# EAGLE design v0.9 (EAGLE 7.2.0)
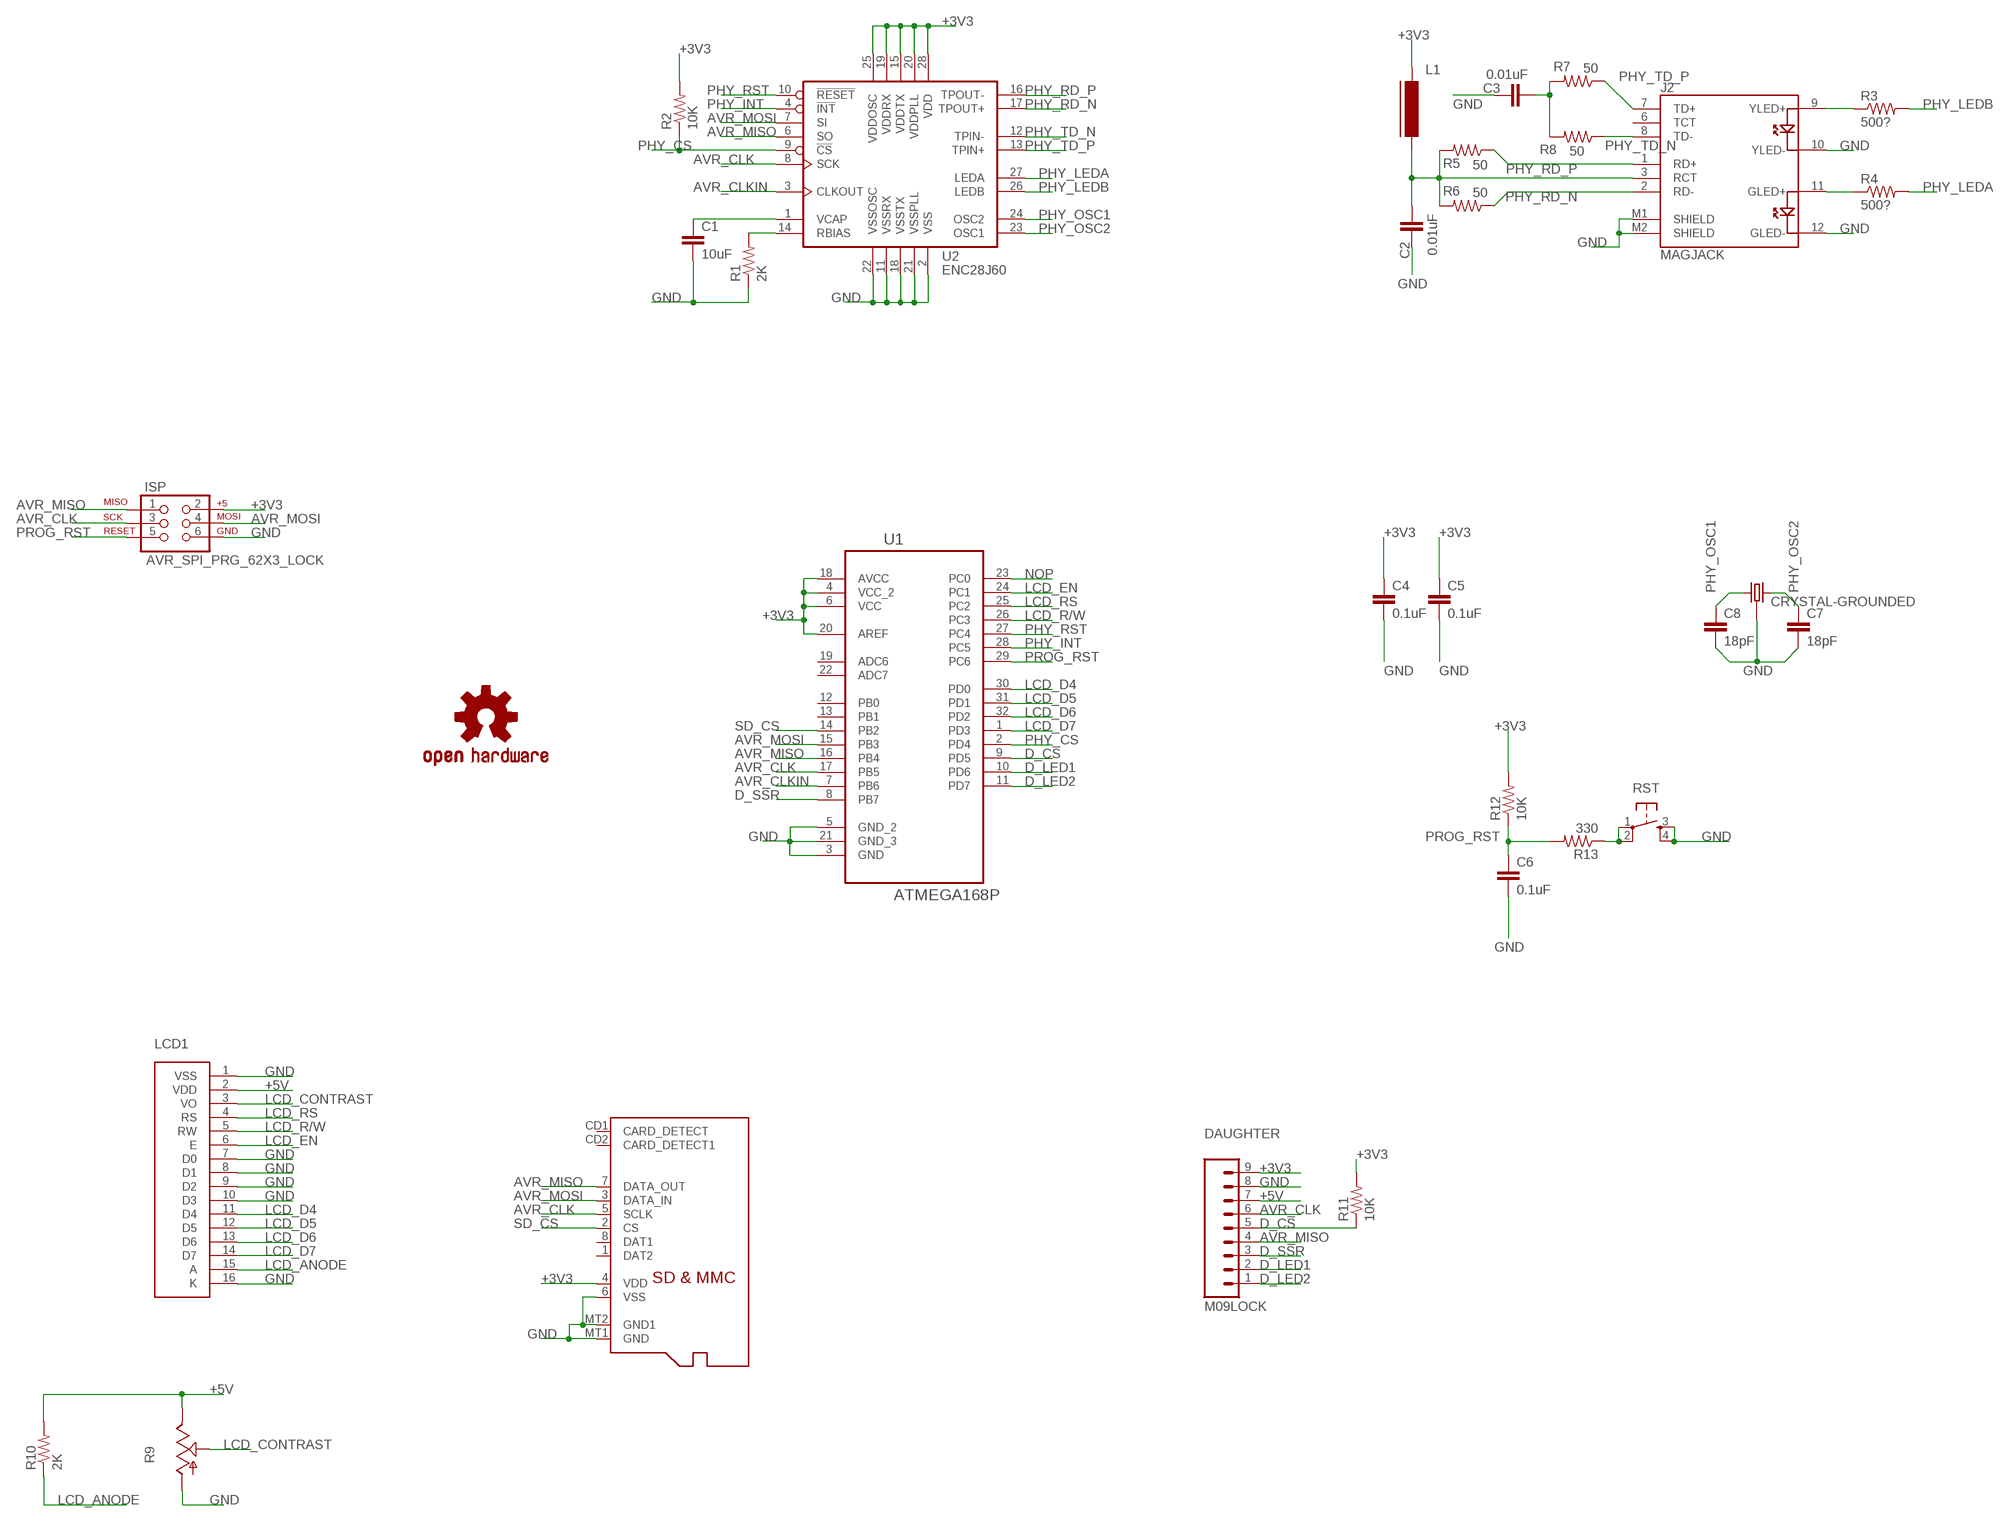
[diagram p0: schematic, sheet 1]

## Parts
C1  10uF  10UF-6.3V-20%(0603)  [0603-CAP]
C2  0.01uF  CAP0603-CAP  [0603-CAP]
C3  0.01uF  CAP0603-CAP  [0603-CAP]
C4  0.1uF  CAP0402-CAP  [0402-CAP]
C5  0.1uF  CAP0402-CAP  [0402-CAP]
C6  0.1uF  CAP0603-CAP  [0603-CAP]
C7  18pF  CAP0402-CAP  [0402-CAP]
C8  18pF  CAP0402-CAP  [0402-CAP]
DAUGHTER  M09LOCK  [1X09_LOCK]
ISP  AVR_SPI_PRG_62X3_LOCK  [2X3_LOCK]
J2  MAGJACK  [MAGJACK]
L1  FERRITE-0603  [FB603]
LCD1  HD44780  [.1"16PIN]
LOGO1  OSHW-LOGOS  [OSHW-LOGO-S]
R1  2K  RESISTOR0603-RES  [0603-RES]
R2  10K  RESISTOR0603-RES  [0603-RES]
R3  500?  RESISTOR0603-RES  [0603-RES]
R4  500?  RESISTOR0603-RES  [0603-RES]
R5  50  RESISTOR0603-RES  [0603-RES]
R6  50  RESISTOR0603-RES  [0603-RES]
R7  50  RESISTOR0603-RES  [0603-RES]
R8  50  RESISTOR0603-RES  [0603-RES]
R9  TRIM_US-B64Y  [B64Y]
R10  2K  RESISTOR0603-RES  [0603-RES]
R11  10K  RESISTOR0603-RES  [0603-RES]
R12  10K  RESISTOR0603-RES  [0603-RES]
R13  330  RESISTOR0603-RES  [0603-RES]
RST  TAC_SWITCHSMD  [TACTILE-SWITCH-SMD]
SD  MICROSD  [MICROSD]
U1  ATMEGA168P  ATMEGA168P-20AU  [QFP80P900X900X120-32N]
U2  ENC28J60  IC_ENC28J60-SOIC-28  [SOIC-28W]
Y1  CRYSTAL-GROUNDED  [CRYSTAL-SMD-5X3]

## Nets
+3V3: C4.1 C5.1 DAUGHTER.9 ISP.2 L1.1 R2.2 R11.2 R12.2 SD.4(VDD) U1.4(VCC_2) U1.6(VCC) U1.18(AVCC) U1.20(AREF) U2.15(VDDTX) U2.19(VDDRX) U2.20(VDDPLL) U2.25(VDDOSC) U2.28(VDD)
+5V: DAUGHTER.7 LCD1.2(VDD) R9.E R10.2
AVR_CLK: DAUGHTER.6 ISP.3 SD.5(SCLK) U1.17(PB5) U2.8(SCK)
AVR_CLKIN: U1.7(PB6) U2.3(CLKOUT)
AVR_MISO: DAUGHTER.4 ISP.1 SD.7(DATA_OUT) U1.16(PB4) U2.6(SO)
AVR_MOSI: ISP.4 SD.3(DATA_IN) U1.15(PB3) U2.7(SI)
D_CS: DAUGHTER.5 R11.1 U1.9(PD5)
D_LED1: DAUGHTER.2 U1.10(PD6)
D_LED2: DAUGHTER.1 U1.11(PD7)
D_SSR: DAUGHTER.3 U1.8(PB7)
GND: C1.2 C2.1 C3.1 C4.2 C5.2 C6.2 C7.2 C8.2 DAUGHTER.8 ISP.6 J2.10(YLED-) J2.12(GLED-) J2.M1(SHIELD) J2.M2(SHIELD) LCD1.1(VSS) LCD1.7(D0) LCD1.8(D1) LCD1.9(D2) LCD1.10(D3) LCD1.16(K) R1.1 R9.A RST.3 RST.4 SD.6(VSS) SD.MT1(GND) SD.MT2(GND1) U1.3(GND) U1.5(GND_2) U1.21(GND_3) U2.2(VSS) U2.11(VSSRX) U2.18(VSSTX) U2.21(VSSPLL) U2.22(VSSOSC) Y1.2 Y1.4
LCD_ANODE: LCD1.15(A) R10.1
LCD_CONTRAST: LCD1.3(VO) R9.S
LCD_D4: LCD1.11(D4) U1.30(PD0)
LCD_D5: LCD1.12(D5) U1.31(PD1)
LCD_D6: LCD1.13(D6) U1.32(PD2)
LCD_D7: LCD1.14(D7) U1.1(PD3)
LCD_EN: LCD1.6(E) U1.24(PC1)
LCD_R/W: LCD1.5(RW) U1.26(PC3)
LCD_RS: LCD1.4(RS) U1.25(PC2)
N$1: J2.11(GLED+) R4.1
N$2: J2.9(YLED+) R3.1
N$4: R13.1 RST.1 RST.2
N$7: C1.1 U2.1(VCAP)
N$8: R1.2 U2.14(RBIAS)
NOP: U1.23(PC0)
PHY_CS: R2.1 U1.2(PD4) U2.9(!CS)
PHY_INT: U1.28(PC5) U2.4(!INT)
PHY_LEDA: R4.2 U2.27(LEDA)
PHY_LEDB: R3.2 U2.26(LEDB)
PHY_OSC1: C8.1 U2.24(OSC2) Y1.3
PHY_OSC2: C7.1 U2.23(OSC1) Y1.1
PHY_RD_N: J2.2(RD-) R6.1 U2.17(TPOUT+)
PHY_RD_P: J2.1(RD+) R5.1 U2.16(TPOUT-)
PHY_RST: U1.27(PC4) U2.10(!RESET)
PHY_TD_N: J2.8(TD-) R8.1 U2.12(TPIN-)
PHY_TD_P: J2.7(TD+) R7.1 U2.13(TPIN+)
PROG_RST: C6.1 ISP.5 R12.1 R13.2 U1.29(PC6)
RCT: C2.2 J2.3(RCT) L1.2 R5.2 R6.2
SD_CS: SD.2(CS) U1.14(PB2)
TDCAP: C3.2 R7.2 R8.2
Unconnected: J2.6(TCT) SD.1(DAT2) SD.8(DAT1) SD.CD1(CARD_DETECT) SD.CD2(CARD_DETECT1) U1.12(PB0) U1.13(PB1) U1.19(ADC6) U1.22(ADC7)

## Library data of the parts
C1 = SparkFun-Capacitors:10UF-6.3V-20%(0603): CAP-11015; PROD_ID: CAP-11015
C2-C8 = SparkFun-Passives:CAP: Capacitor Standard 0603 ceramic capacitor, and 0.1" leaded capacitor.
DAUGHTER = SparkFun-Connectors:M09: Header 9 Standard 9-pin 0.1" header. Use with straight break away headers (SKU : PRT-00116), right angle break away headers (PRT-00553), swiss pins (PRT-00743), machine pins (PRT-00117), and female headers (PRT-00115).
ISP = SparkFun-Connectors:AVR_SPI_PRG_6: AVR ISP 6 Pin This is the reduced ISP connector for AVR programming. Common on Arduino. This footprint will take up less PCB space and can be used with a 10-pin to 6-pin adapter such as SKU: BOB-08508 **Special note about "TEST_POINT" package. The stop mask is on the top side, so if you want your programming test points to be on the bottom of your board, make sure to place this package on the bottom side of the board. This also ensure that the orientation to program from the bottom side will be correct.
J2 = SparkFun-Connectors:MAGJACK: RJ-45 with LEDs
L1 = dp_devices:FERRITE: Ferrite bead in various packages
LCD1 = custom-LCD:HD44780
LOGO1 = SparkFun-Aesthetics:OSHW-LOGO: Open Source Hardware Logo This logo indicates the piece of hardware it is found on incorporates a OSHW license and/or adheres to the definition of open source hardware found here: http://freedomdefined.org/OSHW
R1-R8 R10-R13 = SparkFun-Passives:RESISTOR: Resistor Basic schematic elements and footprints for 0603, 1206, and PTH resistors.
R9 = pot:TRIM_US-: POTENTIOMETER
RST = SparkFun-Electromechanical:TAC_SWITCH: Momentary Switch Button commonly used for reset or general input. Spark Fun Electronics SKU : COM-00097 SMT- SWCH-08247
SD = adafruit:MICROSD: Micro-SD / Transflash card holder with SPI pinout For the 3M # 2908-05WB-MG and/or 4UCON #19656 push-push type
U1 = Atmel_By_element14_Batch_1-00:ATMEGA168P-20AU: 8-bit Microcontroller with In-System Programmable Flash; MPN: ATMEGA168P-20AU; OC_FARNELL: 1636932; OC_NEWARK: 03P2020; PACKAGE: TQFP-32; SUPPLIER: Atmel
U2 = dp_devices:IC_ENC28J60: Ethernet Controller with SPI Interface
Y1 = SparkFun-FreqCtrl:CRYSTAL-GROUNDED

## Board
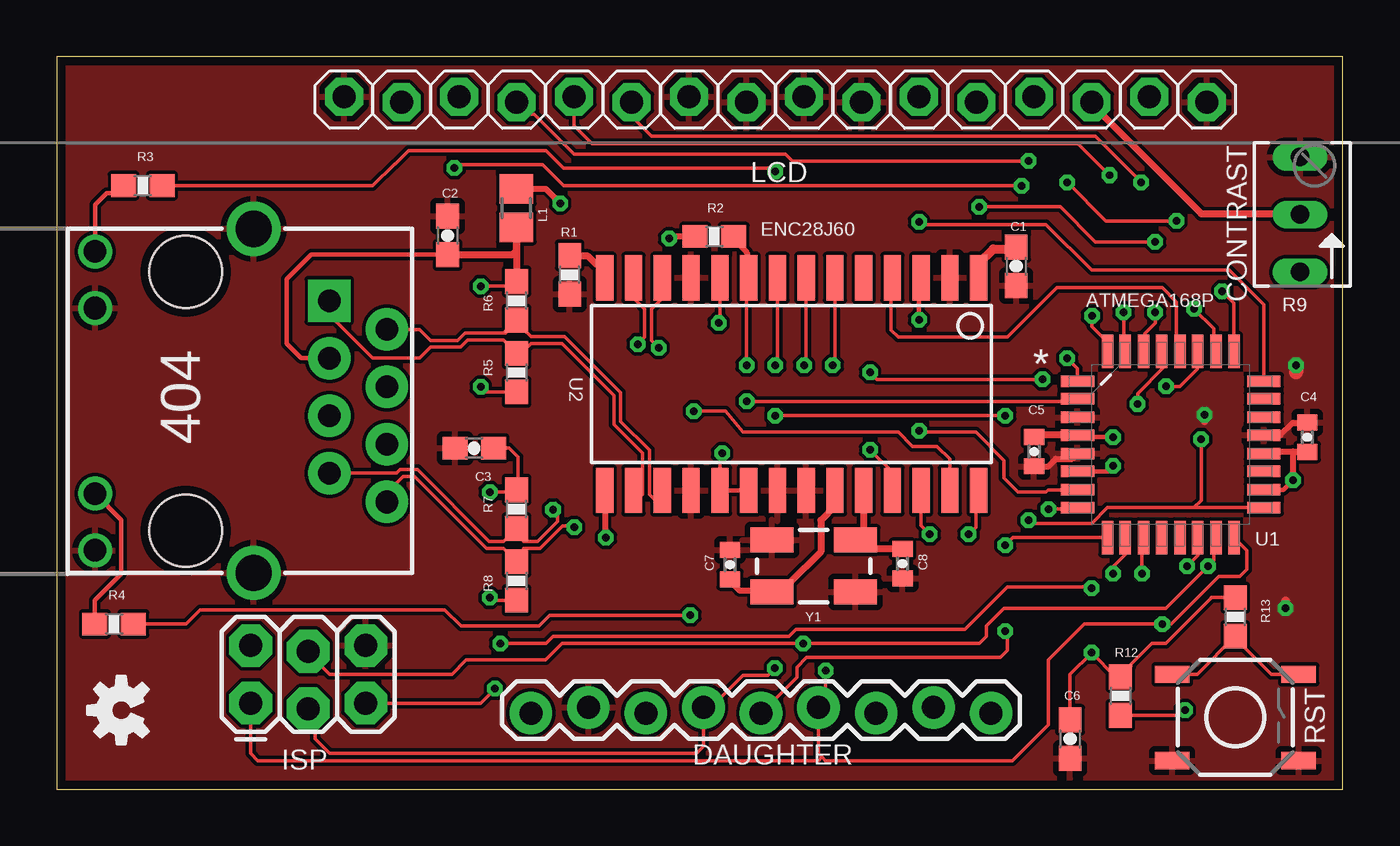
[diagram p1: board, top side]
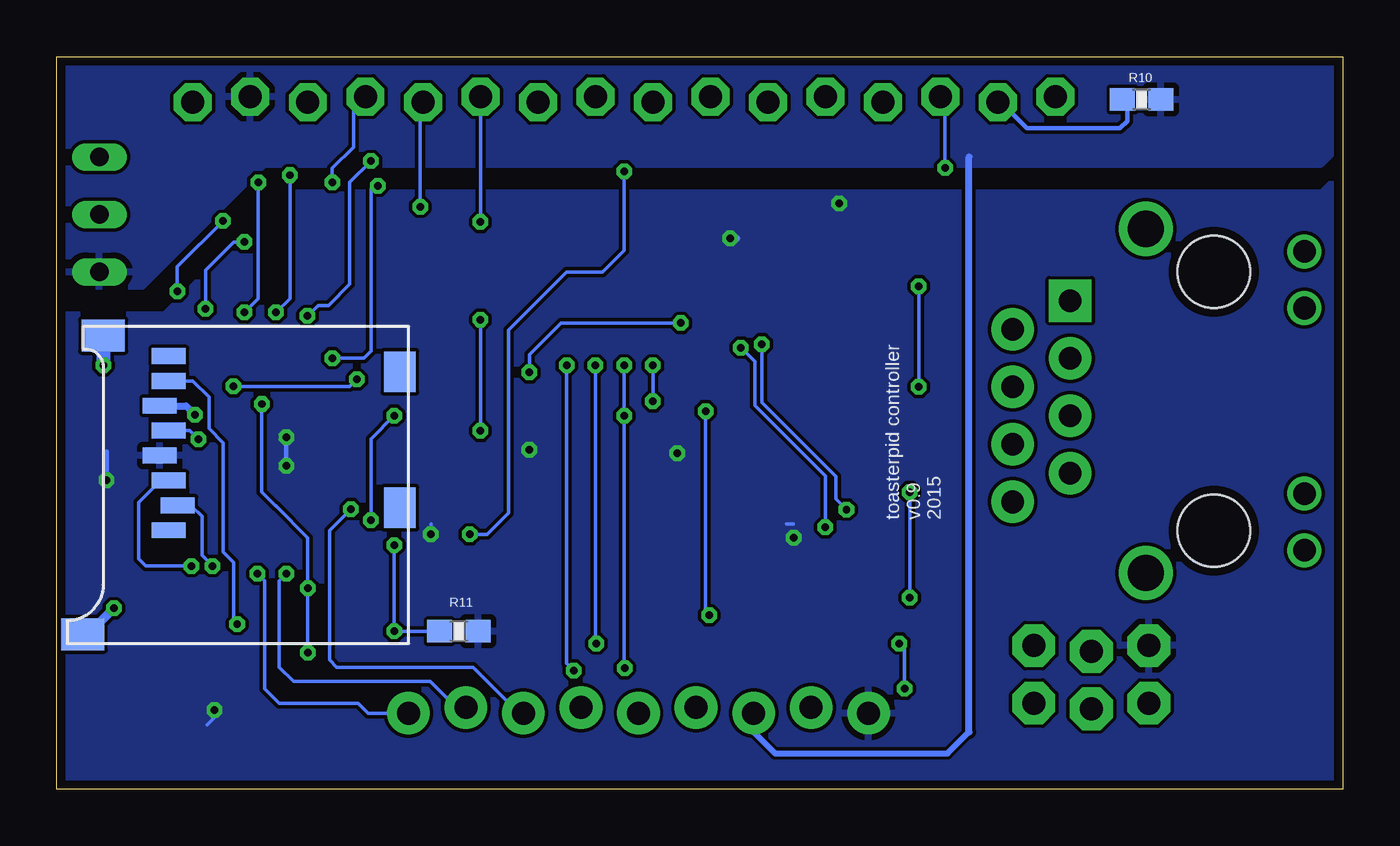
[diagram p2: board, bottom side, seen from below]

Size 56.82 x 32.38 mm. Coordinates in mm from the lower left corner, seen from the top.
Outline: 0,0 56.82,0 56.82,32.38 0,32.38 0,0
Copper layers (1*16): Top 0.0356mm / dielectric 1.5011mm / Bottom 0.0356mm
Design rules "LaenPCBOrder *": minimum track width 6mil, minimum drill 13mil, track to track 6mil, track to pad 6mil, pad to pad 6mil, via to via 6mil, smd to smd 6mil, copper to edge 15mil, drill to drill 6mil, minimum pad ring 7mil, minimum via ring 7mil, stop-mask expansion 3mil, vias tented up to drill 15mil, thermal gap 10mil

### Footprints (pad centres in the part's own frame; a part is rotated, then mirrored left to right if it is on the bottom)
0603-CAP = smd 1.1 x 1: 1 -0.85,0; 2 0.85,0
0402-CAP = smd 0.7 x 0.9: 1 -0.65,0; 2 0.65,0
1X09_LOCK = drill 1.016 pad 1.88: 1 0,0.127; 2 2.54,-0.127; 3 5.08,0.127; 4 7.62,-0.127; 5 10.16,0.127; 6 12.7,-0.127; 7 15.24,0.127; 8 17.78,-0.127; 9 20.32,0.127
2X3_LOCK = drill 1.016 pad 1.88 octagon: 1 0,0; 2 0,2.54; 3 2.54,-0.254; 4 2.54,2.286; 5 5.08,0; 6 5.08,2.54
MAGJACK = drill 1 pad 1.88 square: 1 3.175,17.445 | drill 1 pad 1.88: 2 4.445,19.985; 3 5.715,17.445; 4 6.985,19.985; 5 8.255,17.445; 6 9.525,19.985; 7 10.795,17.445; 8 12.065,19.985 | drill 1 pad 1.27: 9 1,7.1; 10 3.5,7.1; 11 11.7,7.1; 12 14.2,7.1 | drill 1.6 pad 2.184: M1 0,14.1; M2 15.2,14.1 | hole 3.2: 1.905,11.095; 13.335,11.095
FB603 = smd 1.3 x 1.5: 1 -0.85,0; 2 0.85,0
.1"16PIN = drill 1.016 pad 1.676 octagon: 1 0,0.127; 2 2.54,-0.127; 3 5.08,0.127; 4 7.62,-0.127; 5 10.16,0.127; 6 12.7,-0.127; 7 15.24,0.127; 8 17.78,-0.127; 9 20.32,0.127; 10 22.86,-0.127; 11 25.4,0.127; 12 27.94,-0.127; 13 30.48,0.127; 14 33.02,-0.127; 15 35.56,0.127; 16 38.1,-0.127
0603-RES = smd 1.1 x 1: 1 -0.85,0; 2 0.85,0
B64Y = drill 0.813 long: A 2.54,0; E -2.54,0; S 0,0
TACTILE-SWITCH-SMD = smd 1.524 x 0.762: 1 -2.794,1.905; 2 2.794,1.905; 3 -2.794,-1.905; 4 2.794,-1.905
MICROSD = smd 0.7 x 1.5: 1 9,-10.64; 2 7.9,-10.24; 3 6.8,-10.64; 4 5.7,-11.04; 5 4.6,-10.64; 6 3.5,-11.04; 7 2.4,-10.64; 8 1.3,-10.64 | smd 1.8 x 1.4: CD1 2,-0.44; CD2 8,-0.44 | smd 1.4 x 1.9: MT1 0.4,-13.54; MT2 13.6,-14.44
QFP80P900X900X120-32N = smd 1.473 x 0.508: 1 -4.115,2.794; 2 -4.115,2.007; 3 -4.115,1.194; 4 -4.115,0.406; 5 -4.115,-0.406; 6 -4.115,-1.194; 7 -4.115,-2.007; 8 -4.115,-2.794; 17 4.115,-2.794; 18 4.115,-2.007; 19 4.115,-1.194; 20 4.115,-0.406; 21 4.115,0.406; 22 4.115,1.194; 23 4.115,2.007; 24 4.115,2.794 | smd 0.508 x 1.473: 9 -2.794,-4.115; 10 -2.007,-4.115; 11 -1.194,-4.115; 12 -0.406,-4.115; 13 0.406,-4.115; 14 1.194,-4.115; 15 2.007,-4.115; 16 2.794,-4.115; 25 2.794,4.115; 26 2.007,4.115; 27 1.194,4.115; 28 0.406,4.115; 29 -0.406,4.115; 30 -1.194,4.115; 31 -2.007,4.115; 32 -2.794,4.115
SOIC-28W = smd 0.762 x 2: 1 -8.89,-4.7; 2 -7.62,-4.7; 3 -6.35,-4.7; 4 -5.08,-4.7; 5 -3.81,-4.7; 6 -2.54,-4.7; 7 -1.27,-4.7; 8 0,-4.7; 9 1.27,-4.7; 10 2.54,-4.7; 11 3.81,-4.7; 12 5.08,-4.7; 13 6.35,-4.7; 14 7.62,-4.7; 15 7.62,4.7; 16 6.35,4.7; 17 5.08,4.7; 18 3.81,4.7; 19 2.54,4.7; 20 1.27,4.7; 21 0,4.7; 22 -1.27,4.7; 23 -2.54,4.7; 24 -3.81,4.7; 25 -5.08,4.7; 26 -6.35,4.7; 27 -7.62,4.7; 28 -8.89,4.7
CRYSTAL-SMD-5X3 = smd 1.9 x 1.1: 1 -1.85,-1.15; 2 1.85,-1.15; 3 1.85,1.15; 4 -1.85,1.15

### Placement (x,y rotation side)
C1  42.39,23.11 270 top
C2  17.27,24.47 270 top
C3  18.44,15.07 0 top
C4  55.24,15.56 90 top
C5  43.18,14.92 270 top
C6  44.77,2.22 270 top
C7  29.74,9.93 90 top
C8  37.37,9.97 270 top
DAUGHTER  41.27,3.49 180 top
ISP  8.57,3.81 0 top
J2  -5.4,24.77 270 top
L1  20.31,25.68 270 top
LCD1  50.8,30.48 180 top
LOGO1  2.86,3.49 90 top
R1  22.66,22.74 90 top
R2  29.05,24.43 180 top
R3  3.81,26.67 0 top
R4  2.54,7.3 0 top
R5  20.32,18.41 270 top
R6  20.32,21.59 90 top
R7  20.32,12.38 90 top
R8  20.32,9.21 270 top
R9  54.93,25.4 90 top
R10  8.89,30.48 0 bottom
R11  39.05,6.98 0 bottom
R12  46.99,4.13 270 top
R13  52.07,7.62 90 top
RST  52.07,3.17 0 top
SD  41.22,20.45 270 bottom
U1  49.21,15.24 0 top
U2  31.84,17.9 180 top
Y1  33.44,9.87 0 top

### Tracks (layer width: path | path; a pad name or v marks a point on that pad's centre or on a via)
+3V3  (via drill 0.33, 0.33 pad 0.25, 0.33 pad 0.3)
  Top 0.152: 54.61,14.92 54.63,14.92 | R12.2 49.63,3.28 v49.85,3.49 | U2.28 40.6,13.07 40.6,11.58 v40.29,11.27 | U2.25 36.92,14.01 v35.93,15 | U2.19 29.3,14.75 v29.4,14.85
  Top 0.203: U1.18 54.19,13.23 v54.61,13.65 | 53.42,14.92 U1.20 | U1.6 46.43,14.05 v46.67,14.29 | v46.67,15.56 45.19,15.56 U1.4 | U2.20 U2.19 29.3,12.29
  Top 0.254: 53.42,14.92 54.61,14.92 v54.61,13.65 | L1.1 21.6,26.53 v22.24,25.89 | R2.2 27.16,24.43 v27.06,24.34 | U2.15 24.22,11.16 v24.26,11.11
  Top 0.305: 54.63,14.92 C4.1 | U1.4 43.25,15.65 C5.1
  Bottom 0.152: v49.85,3.49 49.85,3.17 50.17,2.86 | 40.29,11.73 v40.29,11.27 | 24.26,11.73 24.57,11.73
  Bottom 0.203: v54.61,13.65 54.61,14.92 | v46.67,14.29 v46.67,15.56
  Bottom 0.254: v27.06,24.34 26.75,24.34 | v24.26,11.11 24.42,11.11
  pour Bottom: 0.32,26.99 0.95,26.35 46.67,26.35 52.07,20.95 56.52,20.95 56.52,0 0,0 0.32,0.32
+5V
  Bottom 0.254: DAUGHTER.7 26.03,2.54 25.08,1.59 17.46,1.59 16.51,2.54
  Bottom 0.305: 16.51,2.54 16.51,27.94
  pour Bottom: 0,28.58 0,32.38 56.83,32.38 56.83,22.23 53.02,22.23 51.75,23.5 47.62,27.62 0.95,27.62
AVR_CLK  (via drill 0.33, 0.33 pad 0.3)
  Top 0.152: U2.8 31.84,18.82 v31.75,18.73 | U1.17 50.24,12.45 | 50.24,12.45 46.42,12.45 45.72,11.75 43.08,11.75 v42.93,11.89 | v41.91,16.51 32.07,16.51 v31.75,16.5 | ISP.3 11.43,3.24 11.43,2.22 12.07,1.59 28.26,1.59 28.57,1.9 DAUGHTER.6 28.89,3.94 29.22,3.94 30.33,5.04 31.42,5.04 v31.73,5.36 | v50.56,15.47 50.56,12.76 50.24,12.45
  Bottom 0.152: v31.75,18.73 v31.75,16.5 31.75,5.38 v31.73,5.36 | SD.5 50.93,15.85 v50.56,15.47 | v42.93,11.89 42.93,15.49 v41.91,16.51
AVR_CLKIN  (via drill 0.33)
  Top 0.152: U1.7 43.81,13.23 43.71,13.13 42.47,13.13 41.84,13.76 41.84,14.54 40.6,15.78 38.19,15.78 v38.1,15.84
  Top 0.203: v38.1,20.75 38.1,21.68 38.11,21.69 38.11,22.52 U2.3
  Bottom 0.152: v38.1,20.75 v38.1,15.84
AVR_MISO  (via drill 0.33)
  Top 0.152: 33.81,1.43 33.65,1.59 DAUGHTER.4 33.97,3.94 v33.97,5.25 | 33.81,1.43 33.97,1.27 42.23,1.27 43.82,2.86 43.82,5.71 45.4,7.3 v48.84,7.3 49.23,7.3 51.33,9.4 52.27,9.4 52.58,9.71 52.58,10.55 U1.16 52.07,11.06 52.07,10.48 | U2.6 34.38,18.82 v34.29,18.73 | ISP.1 8.57,1.59 8.89,1.27 33.65,1.27 33.81,1.43
  Bottom 0.152: v34.29,18.73 34.29,5.57 v33.97,5.25 | SD.7 50.8,18.05 50.09,17.34 50.09,15.93 49.47,15.31 49.47,10.49 49,10.02 49,7.46 v48.84,7.3
AVR_MOSI  (via drill 0.33, 0.33 pad 0.3)
  Top 0.152: U2.7 33.11,18.82 v33.02,18.73 | ISP.4 11.11,6.03 12.07,5.08 17.46,5.08 18.1,5.71 21.59,5.71 22.32,6.45 v32.98,6.45 40.75,6.45 41.07,6.76 41.07,7.22 41.84,8 49,8 v50.87,9.87 51.12,10.12 51.12,11.02 U1.15 51.18,11.08
  Bottom 0.152: v33.02,18.73 33.02,6.49 v32.98,6.45 | SD.3 52.22,13.65 53.2,12.67 53.2,10.18 52.89,9.87 v50.87,9.87
D_CS  (via drill 0.33)
  Top 0.152: U1.9 42.24,11.12 v41.91,10.79 | DAUGHTER.5 32.7,4.95 32.7,5.39 33.13,5.82 41.69,5.82 42,6.13 42,6.9 v41.91,6.98
  Bottom 0.152: v41.91,10.79 v41.91,6.98 R11.1
D_LED1  (via drill 0.33)
  Top 0.152: v46.67,9.53 46.67,9.84 47.31,10.48 47.31,11.02 U1.10
  Bottom 0.152: DAUGHTER.2 39.18,3.62 40.32,4.76 46.35,4.76 46.99,5.4 46.99,9.21 v46.67,9.53
D_LED2  (via drill 0.33)
  Top 0.152: v47.94,9.53 47.94,11.05 U1.11
  Bottom 0.152: DAUGHTER.1 43.05,3.37 43.5,3.81 46.99,3.81 47.63,4.45 47.63,9.21 v47.94,9.53
D_SSR  (via drill 0.33)
  Top 0.152: v43.82,12.38 45.03,12.38 U1.8
  Bottom 0.152: DAUGHTER.3 36.39,3.37 38.42,5.4 44.45,5.4 44.77,5.71 44.77,11.43 v43.82,12.38
GND  (via drill 0.33)
  Top 0.254: U1.21 54.06,15.65 54.61,16.19 55.23,16.19 C4.2 | C5.2 43.8,14.27 44.13,14.61 44.87,14.61 U1.5
  Top 0.305: v50.71,16.56 50.71,16.25
  Top 0.406: v54.29,8 54.29,8.31
  Top 0.61: v54.76,18.74 54.76,18.43
  Bottom 0.305: SD.6 51.1,16.95 v50.71,16.56
  Bottom 0.406: SD.MT2 55.44,6.85 v54.29,8
  Bottom 0.61: SD.MT1 v54.76,18.74
  pour Top: 0,32.38 0,0 56.83,0 56.83,0.95 56.83,32.38
LCD_ANODE
  Bottom 0.203: LCD1.15 15.11,30.35 13.97,29.21 9.84,29.21 9.52,29.53 9.52,30.27 R10.1
LCD_CONTRAST
  Top 0.305: LCD1.3 45.72,30.26 50.56,25.43 54.9,25.43 R9.S
LCD_D4  (via drill 0.33 pad 0.3)
  Top 0.152: LCD1.11 25.4,29.73 26.29,28.85 45.89,28.85 v47.91,26.83 | v48.53,21.07 48.53,20.6 48.07,20.14 48.07,19.4 U1.30
  Bottom 0.152: v47.91,26.83 47.91,21.69 v48.53,21.07
LCD_D5  (via drill 0.33 pad 0.3)
  Top 0.152: LCD1.12 22.86,29.32 23.64,28.54 45.11,28.54 v46.51,27.14 | v47.13,21.07 47.13,19.43 U1.31
  Bottom 0.152: v46.51,27.14 46.51,21.69 v47.13,21.07
LCD_D6  (via drill 0.33, 0.33 pad 0.3)
  Top 0.152: v45.73,20.91 45.73,20.45 46.42,19.76 U1.32 | v42.93,27.76 32.51,27.76 32.2,28.07 22.86,28.07 21.1,29.84 20.84,29.84 LCD1.13
  Bottom 0.152: v45.73,20.91 45.27,21.38 44.8,21.38 43.87,22.31 43.87,26.83 v42.93,27.76
LCD_D7  (via drill 0.33, 0.33 pad 0.3)
  Top 0.152: U1.1 45.1,18.59 v44.64,19.05 | v17.57,27.45 17.73,27.6 21.46,27.6 22.4,26.67 v42.62,26.67
  Bottom 0.152: v17.57,27.45 17.57,30.4 LCD1.14 | v44.64,19.05 43.24,19.05 42.93,19.36 42.93,26.51 v42.62,26.67
LCD_EN  (via drill 0.33)
  Top 0.152: U1.24 53.33,21.41 51.8,22.94 45.73,22.94 43.71,24.96 38.21,24.96 v38.1,25.07
  Bottom 0.152: LCD1.6 v38.1,25.07
LCD_R/W  (via drill 0.33)
  Top 0.152: U1.26 51.12,19.46 51.12,20.35 v50.24,21.23 | v48.53,24.18 45.89,24.18 44.33,25.74 v40.75,25.74
  Bottom 0.152: v40.75,25.74 40.75,30.24 LCD1.5 | v50.24,21.23 50.24,22.94 49,24.18 v48.53,24.18
LCD_RS  (via drill 0.33)
  Top 0.152: U1.25 52.01,21.48 v51.49,22 | v49.47,25.11 46.35,25.11 v44.64,26.83
  Bottom 0.152: v51.49,22 51.49,23.09 v49.47,25.11 | v44.64,26.83 44.64,27.45 43.71,28.38 43.71,30.08 LCD1.4
N$1
  Top 0.203: R4.1 1.69,8.36 2.86,9.53 2.86,11.91 J2.11
N$2
  Top 0.203: J2.9 1.7,25.83 2.22,26.35 2.64,26.35 R3.1
N$4
  Top 0.152: RST.2 53.66,5.08 52.07,6.67 R13.1 50.38,5.08 RST.1
N$7
  Top 0.406: U2.1 40.73,23.22 41.38,23.87 42.3,23.87 C1.1
N$8
  Top 0.305: U2.14 24.22,23.16 23.88,23.16 23.49,23.56 22.69,23.56 R1.2
PHY_CS  (via drill 0.33)
  Top 0.152: v30.48,17.14 45,17.14 U1.2 | v30.48,18.73 30.48,22.51 U2.9
  Top 0.254: R2.1 29.9,24.3 30.49,23.71 30.49,22.68 U2.9
  Bottom 0.152: v30.48,18.73 v30.48,17.14
PHY_INT
  Top 0.152: U2.4 36.86,22.55 36.86,20.29 37.18,19.98 42,19.98 44.18,22.16 48.84,22.16 49.47,21.54 49.47,19.51 U1.28
PHY_LEDA  (via drill 0.33 pad 0.3)
  Top 0.152: R4.2 5.71,7.3 6.35,7.94 17.14,7.94 17.86,7.22 21.31,7.22 21.77,7.69 v28,7.69 | U2.27 39.46,14.59 38.89,15.16 37.8,15.16 37.18,15.78 30.33,15.78 29.55,16.71 v28.15,16.71
  Bottom 0.152: v28.15,16.71 28.15,7.84 v28,7.69
PHY_LEDB  (via drill 0.33, 0.33 pad 0.3)
  Top 0.152: R3.2 13.97,26.67 14.92,27.62 14.95,27.62 15.55,28.23 21.62,28.23 22.4,27.45 31.61,27.45 v31.75,27.3 | U2.26 38.19,11.66 v38.58,11.27
  Bottom 0.152: v31.75,27.3 31.75,23.81 32.7,22.86 34.29,22.86 36.86,20.29 36.86,12.2 37.8,11.27 v38.58,11.27
PHY_OSC1
  Top 0.305: C8.1 35.69,10.62 Y1.3 35.65,11.38 U2.24
PHY_OSC2
  Top 0.254: C7.1 29.74,9.21 30.18,8.78 31.59,8.78
  Top 0.305: U2.23 34.38,12.52 33.75,11.89 33.75,10.49 32.35,9.09 31.96,9.09 Y1.1 31.59,8.78
PHY_RD_N
  Top 0.152: J2.2 16.03,20.32 16.51,19.84 17.72,19.84 18.03,20.16 19.73,20.16 | 19.73,20.16 R6.1 | 19.73,20.16 19.84,20.16 20,20.32 20.64,20.32 20.96,20 22.44,20 24.92,17.53 24.92,16.26 26.19,14.99 26.19,13.02 26.76,12.45 U2.17
PHY_RD_P
  Top 0.152: J2.1 12.05,20.97 13.97,19.05 16.03,19.05 16.51,19.53 17.84,19.53 18.16,19.85 19.73,19.85 R5.1 20.53,19.27 20.96,19.68 22.33,19.68 24.61,17.4 24.61,16.13 25.88,14.86 25.88,13.02 25.49,12.62 U2.16
PHY_RST  (via drill 0.33)
  Top 0.152: U2.10 29.3,20.66 v29.24,20.6 | v43.55,18.11 36.24,18.11 v35.93,18.43 | v49,17.8 49.62,17.8 50.4,18.58 U1.27
  Bottom 0.152: v29.24,20.6 34.53,20.6 35.93,19.2 v35.93,18.43 | v43.55,18.11 43.87,17.8 v49,17.8
PHY_TD_N  (via drill 0.33 pad 0.3)
  Top 0.152: J2.8 14.59,13.1 15.3,13.82 15.81,13.82 18.99,10.64 19.73,10.64 R8.1 20.64,10.38 20.64,10.64 21.36,10.64 22.35,11.63 22.82,11.63 v22.86,11.58 | U2.12 26.76,21.7 26.28,21.23 26.28,19.83 v26.6,19.51
  Bottom 0.152: v26.6,19.51 25.97,18.89 25.97,17.95 | v22.86,11.58 22.86,13.85 25.97,16.96 25.97,17.96 25.97,17.95 | 25.97,17.82 25.97,17.95
PHY_TD_P  (via drill 0.33 pad 0.3)
  Top 0.152: J2.7 15.02,13.97 15.18,14.12 15.94,14.12 19.11,10.95 19.73,10.95 R7.1 20.64,11.21 20.64,10.95 21.24,10.95 22.13,11.84 22.13,12.15 v21.93,12.36 | U2.13 25.49,21.71 25.98,21.23 25.98,19.98 25.97,19.98 v25.66,19.67
  Bottom 0.152: v25.66,19.67 25.66,17.8 25.67,17.8 | v21.93,12.36 22.4,12.82 22.4,13.82 25.67,17.09 25.67,17.8 | 25.67,17.8 25.67,17.96
PROG_RST  (via drill 0.33, 0.33 pad 0.3)
  Top 0.152: ISP.5 18.73,3.81 v19.37,4.45 | U1.29 48.89,19.27 48.89,18.63 47.76,17.49 v47.76,17.02 | C6.1 44.77,5.08 v45.72,6.03 46.78,4.98 R12.1 47.44,5.43 47.44,5.51 48.38,6.45 49,6.45 51.02,8.46 51.02,8.47 R13.2 | v19.6,6.45 21.62,6.45 21.93,6.76 32.35,6.76 32.66,7.07 40.13,7.07 42,8.93 45.68,8.93 v45.72,8.89
  Bottom 0.152: v19.37,4.45 19.37,6.22 v19.6,6.45 | v45.72,6.03 v45.72,8.89 45.72,11.11 47.12,12.51 47.13,12.51 47.76,13.13 v47.76,17.02
RCT  (via drill 0.33 pad 0.25)
  Top 0.152: R5.2 18.95,17.57 v18.73,17.78 | v18.73,22.23 20.1,22.23 R6.2
  Top 0.203: C2.2 11.24,23.62 10.16,22.54 10.16,19.68 10.8,19.05 J2.3
  Top 0.305: C2.2 20.13,23.62 20.32,23.81 20.32,24.82 L1.2 20.31,22.45 R6.2
  Bottom 0.152: v18.73,17.78 v18.73,22.23
SD_CS  (via drill 0.33)
  Top 0.152: U1.14 50.41,10.34 v49.93,9.87
  Bottom 0.152: SD.2 50.9,12.55 50.4,12.05 50.4,10.33 v49.93,9.87
TDCAP  (via drill 0.33 pad 0.3)
  Top 0.152: C3.2 19.99,15.07 20.37,14.69 20.37,13.29 R7.2 | 20.26,13.29 R7.2 | R8.2 19.24,8.36 v19.13,8.47 | v19.13,13.13 20.22,13.13 R7.2
  Bottom 0.152: v19.13,8.47 v19.13,13.13

### Text on the board
tPlace: LCD | ENC28J60
tNames: CONTRAST | 404
bNames: toasterpid controller / v0.9 / 2015